# Altium schematic sheet VFD Ura Controll.SchDoc
size A3
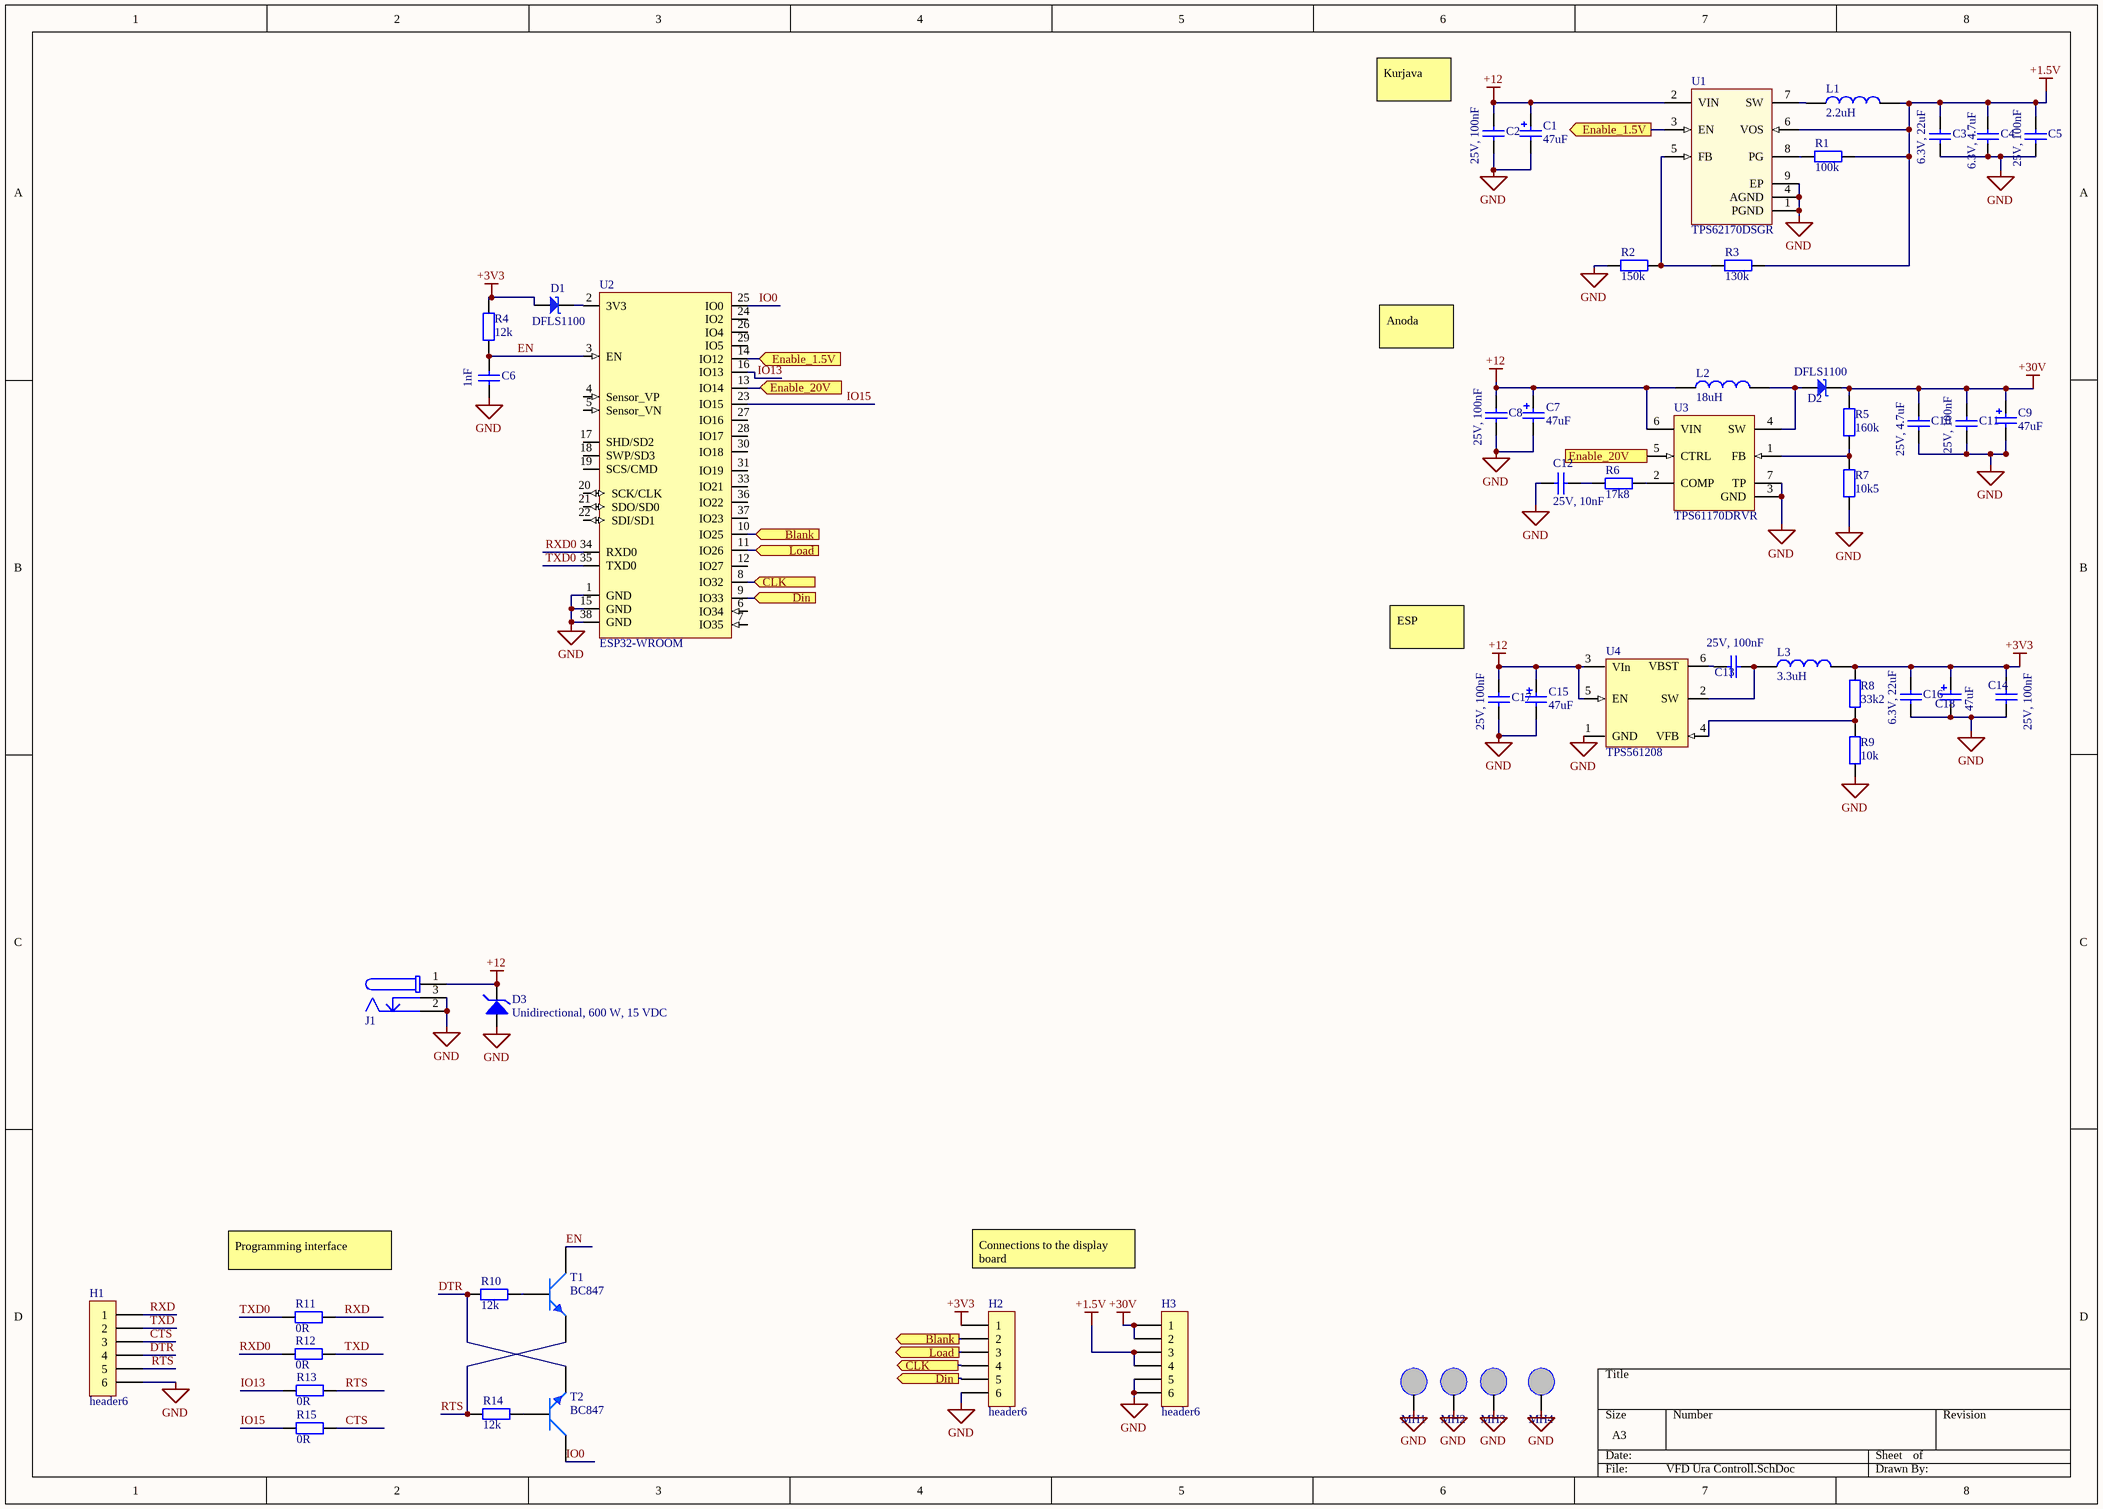
[diagram p0: VFD Ura Controll.SchDoc]

## Parts
C1  value 47uF  [WCAP-PSLC_8x11.7]  (hidden comment: 875075555002)
C2  25V, 100nF  [0603_1.6x0.8x0.8mm_Reflow Soldering]
C3  6.3V, 22uF  [0805_2x1.25x1.25mm_Reflow Soldering]
C4  6.3V, 4.7uF  [0805_2x1.25x1.25mm_Reflow Soldering]
C5  25V, 100nF  [0603_1.6x0.8x0.8mm_Reflow Soldering]
C6  1nF  [0603_1.6x0.8x0.8mm_Reflow Soldering]
C7  value 47uF  [WCAP-PSLC_8x11.7]  (hidden comment: 875075555002)
C8  25V, 100nF  [0603_1.6x0.8x0.8mm_Reflow Soldering]
C9  value 47uF  [WCAP-PSLC_8x11.7]  (hidden comment: 875075555002)
C10  25V, 4.7uF  [0805_2x1.25x1.25mm_Reflow Soldering]
C11  25V, 100nF  [0603_1.6x0.8x0.8mm_Reflow Soldering]
C12  25V, 10nF  [0603_1.6x0.8x0.8mm_Reflow Soldering]
C13  25V, 100nF  [0603_1.6x0.8x0.8mm_Reflow Soldering]
C14  25V, 100nF  [0603_1.6x0.8x0.8mm_Reflow Soldering]
C15  value 47uF  [WCAP-PSLC_8x11.7]  (hidden comment: 875075555002)
C16  6.3V, 22uF  [0805_2x1.25x1.25mm_Reflow Soldering]
C17  25V, 100nF  [0603_1.6x0.8x0.8mm_Reflow Soldering]
C18  value 47uF  [WCAP-PSLC_8x11.7]  (hidden comment: 875075555002)
D1  DFLS1100  [PowerDi123]
D2  DFLS1100  [PowerDi123]
D3  Unidirectional, 600 W, 15 VDC  [DO-214AA_Unidirectional]
H1  header6  [Letev6]
H2  header6  [Letev6]
H3  header6  [Letev6]
J1  694106301002  [694106301002]  (value not drawn)
L1  value 2.2uH  [WE-TPC_2811]  (hidden comment: 744028002)
L2  value 18uH  [WE-TPC_4818]  (hidden comment: 744042180)
L3  value 3.3uH  [WE-TPC_2828]  (hidden comment: 744025003)
MH1  Mounting Hole M3  [Mounting Hole M3]  (value not drawn)
MH2  Mounting Hole M3  [Mounting Hole M3]  (value not drawn)
MH3  Mounting Hole M3  [Mounting Hole M3]  (value not drawn)
MH4  Mounting Hole M3  [Mounting Hole M3]  (value not drawn)
R1  value 100k  [RES0805_1]  (hidden comment: Res2-smd)
R2  value 150k  [RES0805_1]  (hidden comment: Res2-smd)
R3  value 130k  [RES0805_1]  (hidden comment: Res2-smd)
R4  12k  [RES0805_1]
R5  value 160k  [RES0805_1]  (hidden comment: Res2-smd)
R6  value 17k8  [RES0805_1]  (hidden comment: Res2-smd)
R7  value 10k5  [RES0805_1]  (hidden comment: Res2-smd)
R8  value 33k2  [RES0805_1]  (hidden comment: Res2-smd)
R9  value 10k  [RES0805_1]  (hidden comment: Res2-smd)
R10  12k  [RES0805_1]
R11  value 0R  [RES0805_1]  (hidden comment: 12k)
R12  value 0R  [RES0805_1]  (hidden comment: 12k)
R13  value 0R  [RES0805_1]  (hidden comment: 12k)
R14  12k  [RES0805_1]
R15  value 0R  [RES0805_1]  (hidden comment: 12k)
T1  BC847  [SOT23]
T2  BC847  [SOT23]
U1  TPS62170DSGR  [DSG8-1600X900TP]
U2  ESP32-WROOM  [ESP32-WROOM]
U3  TPS61170DRVR  [DRV6-1600X1000TP]
U4  TPS561208  [SOT23-6 TI]

## Ports
Blank (in), Blank (out), CLK (in), CLK (out), Din (in), Din (out), Enable_1.5V (in), Enable_1.5V (out), Enable_20V (in), Enable_20V (out), Load (in), Load (out)

## Nets
+1.5V: C3.2 C4.2 C5.2 H3.3 H3.4 L1.2 R1.2 R3.2 U1.6(VOS)
+3V3: C14.2 C16.2 C18.1(P) D1.1(A) H2.1 L3.2 R4.2 R8.2
+12: C1.1(P) C2.2 C7.1(P) C8.2 C15.1(P) C17.2 D3.1 J1.1 L2.1 U1.2(VIN) U3.6(VIN) U4.3(VIn) U4.5(EN)
+30V: C9.1(P) C10.2 C11.2 D2.2(K) H3.1 H3.2 R5.2
GND: C1.2(N) C2.1 C3.1 C4.1 C5.1 C6.1 C7.2(N) C8.1 C9.2(N) C10.1 C11.1 C12.1 C14.1 C15.2(N) C16.1 C17.1 C18.2(N) D3.2 H1.6 H2.6 H3.5 H3.6 J1.2 J1.3 MH1.1 MH2.1 MH3.1 MH4.1 R2.1 R7.1 R9.1 U1.1(PGND) U1.4(AGND) U1.9(EP) U2.1(GND) U2.15(GND) U2.38(GND) U3.3(GND) U3.7(TP) U4.1(GND)
Blank: H2.2 U2.10(IO25) ; port Blank
CLK: H2.4 U2.8(IO32) ; port CLK
CTS: H1.3 R15.1
Din: H2.5 U2.9(IO33) ; port Din
DTR: H1.4 R10.2 T2.2(E)
EN: C6.2 R4.1 T1.3(C) U2.3(EN)
Enable_1.5V: U1.3(EN) U2.14(IO12) ; port Enable_1.5V
Enable_20V: U2.13(IO14) U3.5(CTRL) ; port Enable_20V
IO0: T2.3(C) U2.25(IO0)
IO13: R13.2 U2.16(IO13)
IO15: R15.2 U2.23(IO15)
Load: H2.3 U2.11(IO26) ; port Load
RTS: H1.5 R13.1 R14.2 T1.2(E)
RXD: H1.1 R11.1
RXD0: R12.2 U2.34(RXD0)
TXD: H1.2 R12.1
TXD0: R11.2 U2.35(TXD0)
NetC12_2: C12.2 R6.1
NetC13_1: C13.1 L3.1 U4.2(SW)
NetC13_2: C13.2 U4.6(VBST)
NetD1_2: D1.2(K) U2.2(3V3)
NetD2_1: D2.1(A) L2.2 U3.4(SW)
NetL1_1: L1.1 U1.7(SW)
NetR1_1: R1.1 U1.8(PG)
NetR2_2: R2.2 R3.1 U1.5(FB)
NetR5_1: R5.1 R7.2 U3.1(FB)
NetR6_2: R6.2 U3.2(COMP)
NetR8_1: R8.1 R9.2 U4.4(VFB)
NetR10_1: R10.1 T1.1(B)
NetR14_1: R14.1 T2.1(B)

Not connected (* = marked no-connect by the designer): U2 4(Sensor_VP) 5(Sensor_VN) 6(IO34) 7(IO35) 12(IO27) 17(SHD/SD2) 18(SWP/SD3) 19(SCS/CMD) 20(SCK/CLK) 21(SDO/SD0) 22(SDI/SD1) 24(IO2) 26(IO4) 27(IO16) 28(IO17) 29(IO5) 30(IO18) 31(IO19) 33(IO21) 36(IO22) 37(IO23)

## Notes on the sheet
- (near C2) Kurjava
- Anoda
- ESP
- Connections to the display board
- (near R11) Programming interface

## Library data of the parts
C1 C7 C9 C15 C18 = 875075555002: WCAP-PSLC Aluminum Polymer Capacitors, size Ф8x11.7mm, 25V DC, 47uF; Rated Voltage: 25V DC; ComponentLink1Description: Manufacturer; ComponentLink1URL: http://www.we-online.de; ComponentLink2Description: Datasheet; ComponentLink2URL: http://katalog.we-online.de/pbs/datasheet/875075555002.pdf; Part Number: 875075555002; Published Date: June 2017; Publisher: Wurth Elektronik; Size: Ф8x11.7mm; Life Cycle: 2000h; Operating Temperature: -55 °C up to +105 °C
C2 C5 C6 C8 C11 C13 C14 C17 = 885012206071: WCAP-CSGP Ceramic Capacitors, 0603, X7R, 25V, 100nF; Rated Voltage: 25V DC; ComponentLink1Description: Manufacturer; ComponentLink1URL: http://www.we-online.de; ComponentLink2Description: Datasheet; ComponentLink2URL: http://katalog.we-online.de/pbs/datasheet/885012206071.pdf; Part Number: 885012206071; Published Date: Oct. 2017; Publisher: Wurth Elektronik; Size: 0603; Operating Temperature: -55 °C to +125 °C; Value: 100nF; Ceramic Type: X7R
C3 C16 = 885012107005: WCAP-CSGP Ceramic Capacitors, 0805, X5R, 6.3V, 22uF; Rated Voltage: 6.3V DC; ComponentLink1Description: Manufacturer; ComponentLink1URL: http://www.we-online.de; ComponentLink2Description: Datasheet; ComponentLink2URL: http://katalog.we-online.de/pbs/datasheet/885012107005.pdf; Part Number: 885012107005; Published Date: Oct. 2017; Publisher: Wurth Elektronik; Size: 0805; Operating Temperature: -55 °C to +125 °C; Value: 22uF; Ceramic Type: X5R
C4 = 885012107003: WCAP-CSGP Ceramic Capacitors, 0805, X5R, 6.3V, 4.7uF; Rated Voltage: 6.3V DC; ComponentLink1Description: Manufacturer; ComponentLink1URL: http://www.we-online.de; ComponentLink2Description: Datasheet; ComponentLink2URL: http://katalog.we-online.de/pbs/datasheet/885012107003.pdf; Part Number: 885012107003; Published Date: Oct. 2017; Publisher: Wurth Elektronik; Size: 0805; Operating Temperature: -55 °C to +125 °C; Value: 4.7uF; Ceramic Type: X5R
C10 = 885012107018: WCAP-CSGP Ceramic Capacitors, 0805, X5R, 25V, 4.7uF; Rated Voltage: 25V DC; ComponentLink1Description: Manufacturer; ComponentLink1URL: http://www.we-online.de; ComponentLink2Description: Datasheet; ComponentLink2URL: http://katalog.we-online.de/pbs/datasheet/885012107018.pdf; Part Number: 885012107018; Published Date: Oct. 2017; Publisher: Wurth Elektronik; Size: 0805; Operating Temperature: -55 °C to +125 °C; Value: 4.7uF; Ceramic Type: X5R
C12 = 885012206065: WCAP-CSGP Ceramic Capacitors, 0603, X7R, 25V, 10nF; Rated Voltage: 25V DC; ComponentLink1Description: Manufacturer; ComponentLink1URL: http://www.we-online.de; ComponentLink2Description: Datasheet; ComponentLink2URL: http://katalog.we-online.de/pbs/datasheet/885012206065.pdf; Part Number: 885012206065; Published Date: Oct. 2017; Publisher: Wurth Elektronik; Size: 0603; Operating Temperature: -55 °C to +125 °C; Value: 10nF; Ceramic Type: X7R
D3 = WE-TVSP DO-214AA, 824520151: WE-TVSP Power TVS Diode, Unidirectional, 600 W, 15 VDC; Manufacturer: Wurth Elektronik; partNo: 824520151; ComponentLink1Description: Manufacturer; ComponentLink1URL: http://www.we-online.de; Created by: Baojun Chen; Created Date: Nov.2015; ComponentLink2Description: Datasheet; ComponentLink2URL: http://katalog.we-online.de/pbs/datasheet/824520151.pdf
J1 = 694106301002: DC Power Jack Right Angled(6.4) WR-DC; Plug OD: 5.5 mm; Rated Current: 5 A; Working Voltage: 24 VAC; Withstanding Voltage: 500 VAC; Opening Diameter: 6.4 mm; ComponentLink1Description: Manufacturer; ComponentLink1URL: http://www.we-online.de; ComponentLink2Description: Datasheet; ComponentLink2URL: http://katalog.we-online.com/em/datasheet/6941xx301002.pdf; Part Number: 694106301002; Published Date: September 2017; Publisher: Wurth Elektronik
L1 = 744028002: WE-TPC SMD Shielded Tiny Power Inductor, size 2811, 1.3A, 125mΩ, 2.2uH; ComponentLink1Description: Manufacturer; ComponentLink1URL: http://www.we-online.de; ComponentLink2Description: Datasheet; ComponentLink2URL: http://katalog.we-online.de/pbs/datasheet/744028002.pdf; Part Number: 744028002; Published Date: July 2017; Publisher: Wurth Elektronik; Rated Current: 1.3A; Size: 2811; DC Resistance: 125mΩ
L2 = 744042180: WE-TPC SMD Shielded Tiny Power Inductor, size 4818, 0.92A, 270mΩ, 18uH; ComponentLink1Description: Manufacturer; ComponentLink1URL: http://www.we-online.de; ComponentLink2Description: Datasheet; ComponentLink2URL: http://katalog.we-online.de/pbs/datasheet/744042180.pdf; Part Number: 744042180; Published Date: July 2017; Publisher: Wurth Elektronik; Rated Current: 0.92A; Size: 4818; DC Resistance: 270mΩ
L3 = 744025003: WE-TPC SMD Shielded Tiny Power Inductor, size 2828, 1.5A, 85mΩ, 3.3uH; ComponentLink1Description: Manufacturer; ComponentLink1URL: http://www.we-online.de; ComponentLink2Description: Datasheet; ComponentLink2URL: http://katalog.we-online.de/pbs/datasheet/744025003.pdf; Part Number: 744025003; Published Date: July 2017; Publisher: Wurth Elektronik; Rated Current: 1.5A; Size: 2828; DC Resistance: 85mΩ
R4 R10-R15 = Res2-smd
  R4 R10 R14: Value: 12k
T1 T2 = BC847: 45 V, 100 mA NPN general-purpose transistors
U1 = TPS62170DSGR: Buck Step Down Regulator with 3 to 17 V Input and 0.9 to 6 V Output, -40 to 85 degC, 8-Pin WSON (DSG), Green (RoHS & no Sb/Br); Manufacturer: Texas Instruments; Duty Cycle(Max)(%): 100; Iout(Max)(A): 0.5; Iq(Typ)(mA): 0.017; Rating: Catalog; Regulated Outputs(#): 1; SubFamily: Step-Down Regulator; Switch Current Limit(Typ)(A): 1.05; Synchronous Rectification: TRUE; Vin(Max)(V): 17; Vin(Min)(V): 3; Vout(Max)(V): 6; Vout(Min)(V): 0.9; DatasheetVersion: SLVSAT8A; PackageVersion: revB, Oct-2010; PackageReference: DSG8-1600X900TP; PackageDescription: 8-Pin Plastic Small Outline No-Lead, 2 x 2 x 0.8 mm Body, 0.5 mm Pitch, Exposed Pad; Supplier 1: Digi-Key; Supplier Part Number 1: 296-29865-2-ND; Supplier 2: Digi-Key; Supplier Part Number 2: 296-29865-1-ND; Supplier 3: Digi-Key; Supplier Part Number 3: 296-29865-6-ND; Supplier 4: Newark; Supplier Part Number 4: 74T5561; Supplier 5: Mouser; Supplier Part Number 5: 595-TPS62170DSGR; Eco-Plan: Green (RoHS & no Sb/Br); Topology: Buck; Mounting Technology: Surface Mount; Code_JEDEC: MO-229; PartNumber: TPS62170DSGR; ComponentLink1Description: Datasheet; ComponentLink1URL: http://www.ti.com/general/docs/lit/getliterature.tsp?genericPartNumber=TPS62170&fileType=pdf; ComponentLink2Description: Package Specification; ComponentLink2URL: http://www.ti.com/litv/pdf/mpds308a; ComponentLink3Description: URL Link1; ComponentLink3URL: Samples URL:http://www.ti.com/product/tps62170#samples
U3 = TPS61170DRVR: Boost Voltage Converter with 3 to 18 V Input and 3 to 38 V Output, -40 to 85 degC, 6-Pin SON (DRC), Green (RoHS & no Sb/Br); Manufacturer: Texas Instruments; Dynamic Voltage Scaling: TRUE; Regulated Outputs(#): 1; SubFamily: Step-Up Regulator; Switching Frequency(Max)(kHz): 1200; Vin(Max)(V): 18; Vin(Min)(V): 3; Vout(Max)(V): 38; DatasheetVersion: SLVS789C; PackageVersion: revE, Oct-2010; PackageReference: DRV6-1600X1000TP; PackageDescription: 6-Pin Plastic Small Outline No-Lead, 2 x 2 x 0.8 mm Body, 0.65 mm Pitch, Exposed Pad; Supplier 1: Digi-Key; Supplier Part Number 1: 296-22945-2-ND; Supplier 2: Digi-Key; Supplier Part Number 2: 296-22945-1-ND; Supplier 3: Digi-Key; Supplier Part Number 3: 296-22945-6-ND; Supplier 4: Newark; Supplier Part Number 4: 65M6341; Supplier 5: Mouser; Supplier Part Number 5: 595-TPS61170DRVR; Eco-Plan: Green (RoHS & no Sb/Br); Topology: Boost; Vout(Min)(V): 3; Mounting Technology: Surface Mount; PartNumber: TPS61170DRVR; ComponentLink1Description: Datasheet; ComponentLink1URL: http://www.ti.com/general/docs/lit/getliterature.tsp?genericPartNumber=TPS61170&fileType=pdf; ComponentLink2Description: Package Specification; ComponentLink2URL: http://www.ti.com/litv/pdf/mpds216d